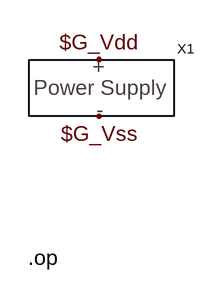
[diagram p0: schematic tpower_test.asc]
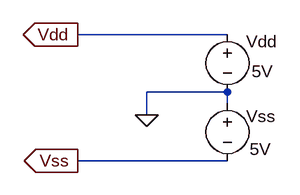
[diagram p1: sub-circuit tpower.asc]
tpower_test.asc, the LTspice schematic file:
Version 4
SHEET 1 880 680
FLAG 160 144 $G_Vdd
FLAG 160 208 $G_Vss
SYMBOL tpower 160 176 R0
SYMATTR InstName X1
TEXT 80 368 Left 0 !.op

tpower.asc, the sub-circuit schematic file:
Version 4
SHEET 1 880 680
WIRE -112 32 -320 32
WIRE -112 112 -224 112
WIRE -112 128 -112 112
WIRE -224 144 -224 112
WIRE -112 208 -320 208
FLAG -224 144 0
FLAG -320 32 Vdd
IOPIN -320 32 Out
FLAG -320 208 Vss
IOPIN -320 208 Out
SYMBOL voltage -112 16 R0
WINDOW 0 26 26 Left 0
WINDOW 3 34 68 Left 0
SYMATTR InstName Vdd
SYMATTR Value 5V
SYMBOL voltage -112 112 R0
WINDOW 0 26 34 Left 0
WINDOW 3 31 80 Left 0
SYMATTR InstName Vss
SYMATTR Value 5V

The netlist it stands for:
* tpower_test.asc
XX1 $G_Vdd $G_Vss tpower

* block symbol definitions
.subckt tpower Vdd Vss
Vdd Vdd 0 5V
Vss 0 Vss 5V
.ends tpower

.op
.backanno
.end